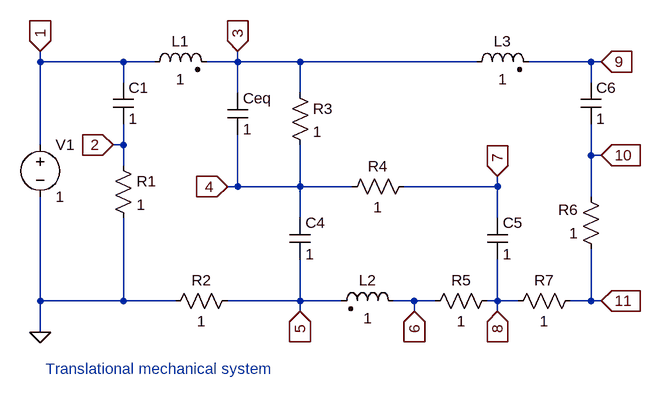
[diagram p0: schematic transilation-mech-sys.asc]
transilation-mech-sys.asc, the LTspice schematic file:
Version 4
SHEET 1 1088 680
WIRE -16 80 -16 64
WIRE 112 80 -16 80
WIRE 160 80 112 80
WIRE 288 80 288 64
WIRE 288 80 240 80
WIRE 384 80 288 80
WIRE 656 80 384 80
WIRE 832 80 736 80
WIRE 848 80 832 80
WIRE 112 112 112 80
WIRE 832 112 832 80
WIRE 288 128 288 80
WIRE 384 128 384 80
WIRE -16 208 -16 80
WIRE 112 208 112 176
WIRE 112 208 96 208
WIRE 832 224 832 176
WIRE 848 224 832 224
WIRE 112 240 112 208
WIRE 288 272 288 192
WIRE 288 272 272 272
WIRE 384 272 384 208
WIRE 384 272 288 272
WIRE 464 272 384 272
WIRE 688 272 688 256
WIRE 688 272 544 272
WIRE 832 288 832 224
WIRE 384 320 384 272
WIRE 688 320 688 272
WIRE -16 448 -16 288
WIRE 112 448 112 320
WIRE 112 448 -16 448
WIRE 192 448 112 448
WIRE 384 448 384 384
WIRE 384 448 272 448
WIRE 448 448 384 448
WIRE 560 448 528 448
WIRE 592 448 560 448
WIRE 688 448 688 384
WIRE 688 448 672 448
WIRE 720 448 688 448
WIRE 832 448 832 368
WIRE 832 448 800 448
WIRE 848 448 832 448
WIRE 384 464 384 448
WIRE 560 464 560 448
WIRE 688 464 688 448
WIRE -16 496 -16 448
FLAG -16 496 0
FLAG -16 64 1
IOPIN -16 64 In
FLAG 96 208 2
IOPIN 96 208 In
FLAG 288 64 3
IOPIN 288 64 In
FLAG 272 272 4
IOPIN 272 272 In
FLAG 384 464 5
IOPIN 384 464 In
FLAG 560 464 6
IOPIN 560 464 In
FLAG 688 464 8
IOPIN 688 464 In
FLAG 848 448 11
IOPIN 848 448 In
FLAG 848 224 10
IOPIN 848 224 In
FLAG 848 80 9
IOPIN 848 80 In
FLAG 688 256 7
IOPIN 688 256 In
SYMBOL voltage -16 192 R0
WINDOW 123 0 0 Left 0
WINDOW 39 0 0 Left 0
SYMATTR InstName V1
SYMATTR Value 1
SYMBOL cap 96 112 R0
SYMATTR InstName C1
SYMATTR Value 1
SYMBOL cap 272 128 R0
SYMATTR InstName Ceq
SYMATTR Value 1
SYMBOL cap 368 320 R0
SYMATTR InstName C4
SYMATTR Value 1
SYMBOL cap 672 320 R0
SYMATTR InstName C5
SYMATTR Value 1
SYMBOL cap 816 112 R0
SYMATTR InstName C6
SYMATTR Value 1
SYMBOL res 96 224 R0
SYMATTR InstName R1
SYMATTR Value 1
SYMBOL res 288 432 R90
WINDOW 0 0 56 VBottom 2
WINDOW 3 32 56 VTop 2
SYMATTR InstName R2
SYMATTR Value 1
SYMBOL res 368 112 R0
SYMATTR InstName R3
SYMATTR Value 1
SYMBOL res 560 256 R90
WINDOW 0 0 56 VBottom 2
WINDOW 3 32 56 VTop 2
SYMATTR InstName R4
SYMATTR Value 1
SYMBOL res 688 432 R90
WINDOW 0 0 56 VBottom 2
WINDOW 3 32 56 VTop 2
SYMATTR InstName R5
SYMATTR Value 1
SYMBOL res 816 432 R90
WINDOW 0 0 56 VBottom 2
WINDOW 3 32 56 VTop 2
SYMATTR InstName R7
SYMATTR Value 1
SYMBOL res 848 384 R180
WINDOW 0 36 76 Left 2
WINDOW 3 36 40 Left 2
SYMATTR InstName R6
SYMATTR Value 1
SYMBOL ind2 144 96 R270
WINDOW 0 32 56 VTop 2
WINDOW 3 5 56 VBottom 2
SYMATTR InstName L1
SYMATTR Value 1
SYMATTR Type ind
SYMBOL ind2 640 96 R270
WINDOW 0 32 56 VTop 2
WINDOW 3 5 56 VBottom 2
SYMATTR InstName L3
SYMATTR Value 1
SYMATTR Type ind
SYMBOL ind2 544 464 M270
WINDOW 0 32 56 VTop 2
WINDOW 3 5 56 VBottom 2
SYMATTR InstName L2
SYMATTR Value 1
SYMATTR Type ind
TEXT -8 552 Left 2 ;Translational mechanical system

The netlist it stands for:
* transilation-mech-sys.asc
V1 1 0 1
C1 1 2 1
Ceq 3 4 1
C4 4 5 1
C5 7 8 1
C6 9 10 1
R1 2 0 1
R2 5 0 1
R3 3 4 1
R4 7 4 1
R5 8 6 1
R7 11 8 1
R6 11 10 1
L1 1 3 1
L3 3 9 1
L2 6 5 1
* Translational mechanical system
.backanno
.end